# EAGLE design blink1mk3_003 (EAGLE 9.0.0)
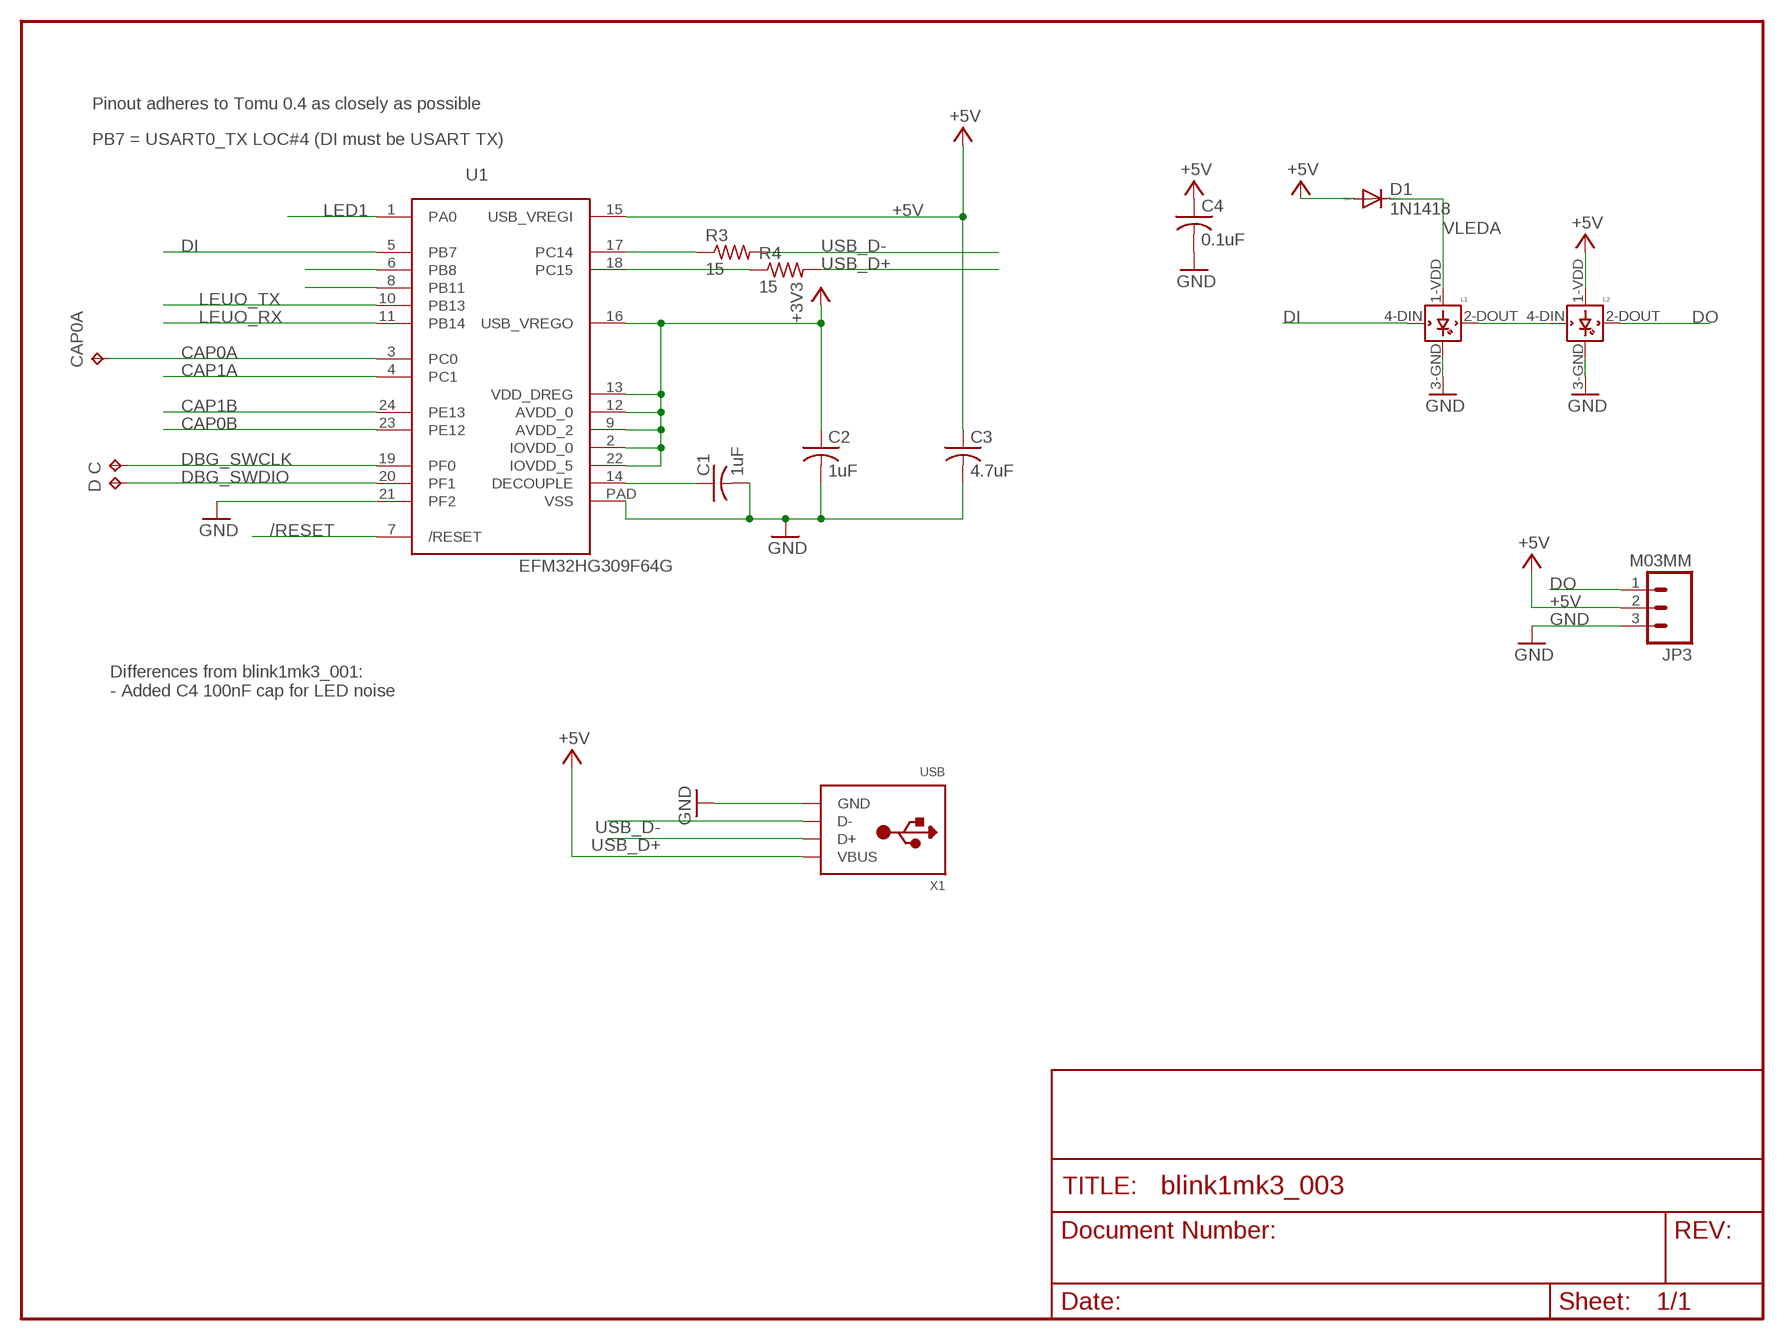
[diagram p0: schematic, sheet 1]

## Parts
C  TPTP10R  [TP10R]
C1  1uF  C-USC0402  [C0402]
C2  1uF  C-USC0402  [C0402]
C3  4.7uF  C-USC0402  [C0402]
C4  0.1uF  C-USC0402  [C0402]
CAP0A  TPTP10R  [TP10R]
D  TPTP10R  [TP10R]
D1  1N1418  DIODE-SOD523  [SOD523]
JP3  M03MM  [1X03-1.5MM]
L1  WS2812B  [WS2812B]
L2  WS2812B  [WS2812B]
R3  15  R-US_R0402  [R0402]
R4  15  R-US_R0402  [R0402]
U1  EFM32HG309F64G  [QFN24PAD]
X1  USB  [MOLEX-48037-1000]

## Nets
+3V3: C2.1 U1.2(IOVDD_0) U1.9(AVDD_2) U1.12(AVDD_0) U1.13(VDD_DREG) U1.16(USB_VREGO) U1.22(IOVDD_5)
+5V: C3.1 C4.1 D1.A JP3.2 L2.1-VDD(VDD) U1.15(USB_VREGI) X1.1(VBUS)
/RESET: U1.7(/RESET)
CAP0A: CAP0A.TP U1.3(PC0)
CAP0B: U1.23(PE12)
CAP1A: U1.4(PC1)
CAP1B: U1.24(PE13)
DBG_SWCLK: C.TP U1.19(PF0)
DBG_SWDIO: D.TP U1.20(PF1)
DECOUPLE: C1.1 U1.14(DECOUPLE)
DI: L1.4-DIN(DIN) U1.5(PB7)
DO: JP3.1 L2.2-DOUT(DOUT)
GND: C1.2 C2.2 C3.2 C4.2 JP3.3 L1.3-GND(GND) L2.3-GND(GND) U1.21(PF2) U1.PAD(VSS) X1.4(GND)
LED1: U1.1(PA0)
LEUO_RX: U1.11(PB14)
LEUO_TX: U1.10(PB13)
N$1: U1.8(PB11)
N$2: L1.2-DOUT(DOUT) L2.4-DIN(DIN)
N$3: U1.6(PB8)
RUSB_D+: R4.1 U1.18(PC15)
RUSB_D-: R3.1 U1.17(PC14)
USB_D+: R4.2 X1.3(D+)
USB_D-: R3.2 X1.2(D-)
VLEDA: D1.C L1.1-VDD(VDD)

## Notes on the sheet
- Pinout adheres to Tomu 0.4 as closely as possible
- PB7 = USART0_TX LOC#4 (DI must be USART TX)
- Differences from blink1mk3_001:
  - Added C4 100nF cap for LED noise

## Library data of the parts
C CAP0A D = testpad:TP: Test pad
C1-C4 = adafruit:C-US: CAPACITOR, American symbol
D1 = diode:DIODE-: DIODE
JP3 = todstuff:M03
L1 L2 = adafruit:WS2812B
R3 R4 = adafruit:R-US_: RESISTOR, American symbol
U1 = todstuff:EFM32HG309F64G
X1 = todstuff:USB

## Board
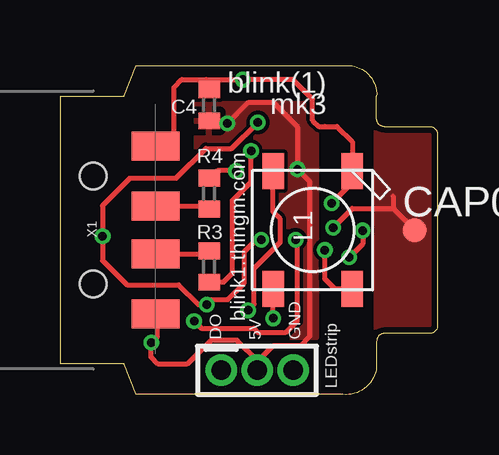
[diagram p1: board, top side]
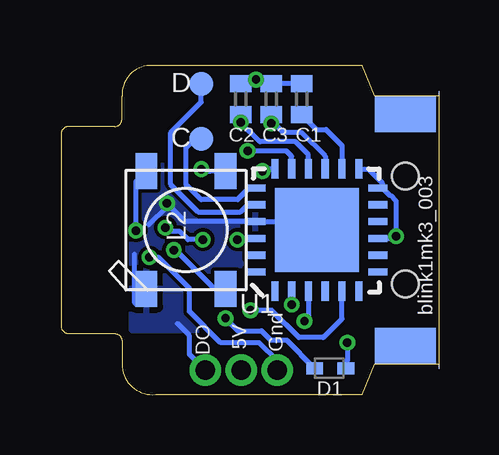
[diagram p2: board, bottom side, seen from below]

Size 15.75 x 13.72 mm. Coordinates in mm from the lower left corner, seen from the top.
Outline: 0,12.45 2.67,12.45 3.17,13.72 12.06,13.72 arc-90 13.21,12.45 13.21,11.5 arc90 13.53,11.18 15.43,11.18 arc-90 15.75,10.86 15.75,2.86 arc-90 15.43,2.55 13.53,2.55 arc90 13.21,2.23 13.21,1.15 arc-90 11.81,0.01 3.17,0.01 2.67,1.28 0,1.28 0,12.45
Copper layers (1*16): Top 0.035mm / dielectric 1.5mm / Bottom 0.035mm
Design rules "SeeedStudio_2layer_DRU_no_angle_20140221": minimum track width 6mil, minimum drill 12mil, track to track 6mil, track to pad 6mil, pad to pad 6mil, via to via 6mil, smd to smd 0mil, copper to edge 10mil, drill to drill 10mil, minimum pad ring 10mil, minimum via ring 6mil, stop-mask expansion 2mil, vias tented up to drill 100mil, thermal gap 10mil

### Footprints (pad centres in the part's own frame; a part is rotated, then mirrored left to right if it is on the bottom)
TP10R = smd 1 x 1: TP 0,0
C0402 = smd 0.7 x 0.9: 1 -0.65,0; 2 0.65,0
SOD523 = smd 0.7 x 0.5: A 0.7,0; C -0.6,0
1X03-1.5MM = drill 0.8 pad 1.27: 1 0,0; 2 1.5,0; 3 3,0
WS2812B = smd 1.5 x 0.9: 1-VDD 2.45,-1.65; 2-DOUT 2.45,1.65; 3-GND -2.45,1.65; 4-DIN -2.45,-1.65
R0402 = smd 0.7 x 0.9: 1 -0.65,0; 2 0.65,0
QFN24PAD = smd 0.8 x 0.3: 1 -2.55,1.75; 2 -2.55,1.05; 3 -2.55,0.35; 4 -2.55,-0.35; 5 -2.55,-1.05; 6 -2.55,-1.75; 13 2.55,-1.75; 14 2.55,-1.05; 15 2.55,-0.35; 16 2.55,0.35; 17 2.55,1.05; 18 2.55,1.75 | smd 0.3 x 0.8: 7 -1.75,-2.55; 8 -1.05,-2.55; 9 -0.35,-2.55; 10 0.35,-2.55; 11 1.05,-2.55; 12 1.75,-2.55; 19 1.75,2.55; 20 1.05,2.55; 21 0.35,2.55; 22 -0.35,2.55; 23 -1.05,2.55; 24 -1.75,2.55 | smd 3.5 x 3.5: PAD 0,0
MOLEX-48037-1000 = smd 2 x 1.2: 1 2.6,-3.5; 2 2.6,-1; 3 2.6,1; 4 2.6,3.5 | smd 2.54 x 1.524 bottom: P$1 0,4.85; P$2 0,-4.85 | hole 1.1: 0,2.25; 0,-2.25

### Placement (x,y rotation side)
C  9.91,10.67 0 bottom
C1  5.71,12.33 90 bottom
C2  8.25,12.33 90 bottom
C3  6.99,12.33 90 bottom
C4  6.22,12.07 90 top
CAP0A  14.8,6.86 0 top
D  9.91,12.96 0 bottom
D1  4.57,1.1 0 bottom
JP3  6.73,1.02 0 top
L1  10.54,6.86 270 top
L2  10.54,6.86 90 bottom
R3  6.22,5.34 90 top
R4  6.22,8.39 270 top
U1  5.08,6.86 90 bottom
X1  1.39,6.86 0 top

### Tracks (layer width: path | path; a pad name or v marks a point on that pad's centre or on a via)
+3V3  (via drill 0.35)
  Top 0.203: v8.25,11.36 7.16,10.26 6.09,10.26 4.85,9.02 2.92,9.02 1.78,7.88 v1.78,6.61 1.78,5.59 2.79,4.58 4.95,4.58 5.77,3.76 v6.13,3.76 6.34,3.96 7,3.96 7.7,4.66 7.7,5.96 8.2,6.46 v8.4,6.46
  Bottom 0.203: U1.13 2.93,9.41 2.35,8.83 2.35,8.61 | U1.9 1.87,6.51 v1.78,6.61 1.78,8.07 2.02,8.32 2.05,8.32 2.35,8.61 | U1.12 2.35,8.61 | U1.2 v6.13,3.76 | U1.16 5.46,9.45 5.46,10.04 5.97,10.55 7.45,10.55 v8.25,11.36 | C2.1 v8.25,11.36 | v8.25,11.36 | U1.22 8.35,6.51 v8.4,6.46
+5V  (via drill 0.35)
  Top 0.203: 4.02,3.36 X1.1 4.05,3.3 4.05,2.41 v3.81,2.17 3.81,1.58 3.8,1.56 4.1,1.26 5.3,1.26 6.3,2.26 7.39,2.26 8.25,1.4 | 8.25,1.4 8.23,1.38 JP3.2 | 8.25,1.4 8.89,2.04 10.03,2.04 10.41,2.42 10.41,8.9 v9.91,9.4 9.91,11.18 8.89,12.2 7.87,12.2 v6.99,11.31 6.33,11.31 C4.1
  Bottom 0.203: L2.1-VDD 9.53,9.31 9.91,9.31 v9.91,9.4 | v6.99,11.31 6.94,11.34 C3.1 v6.99,11.31 | U1.15 4.73,9.94 5.71,10.93 6.48,10.93 6.86,11.31 v6.99,11.31 | v3.81,2.17 3.81,1.47 D1.A
  pour Top: 5.7,12.16 10.7,12.16 10.7,2.36 7.6,2.36 7.6,10.26 5.7,10.26
CAP0A  (via drill 0.35)
  Top 0.203: v9.83,6.46 9.9,6.46 9.9,3.06 9.43,2.6 8.25,2.6 8.08,2.76 5.9,2.76 v5.6,3.06 | 13.9,8.26 13.9,7.76 | 13.9,7.76 CAP0A.TP | v11.4,6.96 12.2,7.76 13.9,7.76
  Bottom 0.203: v11.4,6.96 11.24,6.81 10.81,6.81 10.46,6.46 v9.83,6.46 | v5.6,3.06 5.43,3.23 U1.3
  pour Top (no thermals): 13.2,11.16 15.8,11.16 15.8,2.36 13.2,2.36
DBG_SWCLK
  Bottom 0.203: U1.19 7.9,8.61 8.38,8.13 9.91,8.13 10.54,8.77 10.54,10.29 10.16,10.67 C.TP
DBG_SWDIO
  Bottom 0.203: U1.20 7.97,7.91 8.25,7.63 10.03,7.63 11.18,8.77 11.18,10.93 9.91,12.2 9.91,12.63 9.91,12.83 D.TP
DECOUPLE
  Bottom 0.152: 5.71,11.44 C1.1
  Bottom 0.203: C1.1 5.09,11.06 4.7,11.06 4.03,10.39 U1.14
DI  (via drill 0.35)
  Top 0.203: L1.4-DIN 8.89,7.63 9.2,7.32 9.2,6.36 8.1,5.26 8.1,3.76 v7.85,3.51
  Bottom 0.203: U1.5 4.03,3.16 4.81,2.38 5.84,2.38 6.97,3.51 v7.85,3.51
DO  (via drill 0.35)
  Top 0.203: v12.06,5.73 12.63,6.29 v12.63,6.84
  Bottom 0.203: v12.63,6.84 12.63,8.88 L2.2-DOUT | JP3.1 6.73,1.4 7.49,2.17 9.1,2.17 10.4,3.46 10.4,4.43 11.69,5.73 v12.06,5.73
GND  (via drill 0.35)
  Top 0.203: L1.3-GND 12.19,8.71 | 6.1,13.14 5.08,13.14 4.75,12.81 4.75,10.47 4.64,10.36 X1.4 | 6.1,13.14 v7.62,13.14 9.72,13.14 10.54,12.33 10.54,11.44 10.79,11.18 11.05,11.18 | 11.05,11.18 11.56,11.18 12.19,10.55 L1.3-GND | 11.06,11.17 11.05,11.18 | C4.2 6.1,12.85 6.1,13.14 | L1.3-GND 12.19,8.84 v11.33,7.98
  Bottom 0.203: 5.56,7.21 U1.PAD | 11.23,7.88 v11.33,7.98 | 5.33,6.86 U1.PAD | U1.PAD 5.43,7.21 U1.21 10.57,7.21 11.23,7.88 | v7.62,13.14 8.42,13.14 C2.2 C3.2 C1.2 | 11.23,7.88 11.35,7.96 11.35,7.83 12.1,7.09 | JP3.3 10.4,1.69 10.4,2.46 10.9,2.96 | L2.3-GND 12.19,4.17 12.6,3.76 12.7,3.86 12.7,5.86
  pour Bottom: 7.6,9.56 7.6,2.66 12.8,2.66 12.8,9.46 12.7,9.56
N$2  (via drill 0.35)
  Top 0.203: 11.97,4.41 L1.2-DOUT 11.47,4.41 11.05,4.83 v11.05,6.03
  Bottom 0.203: L2.4-DIN 9.35,4.41 10.96,6.03 v11.05,6.03
RUSB_D+  (via drill 0.35)
  Top 0.203: R4.1 6.27,9.04 6.6,9.36 7.3,9.36 v7.35,9.32
  Bottom 0.203: U1.18 7.31,9.41 v7.35,9.32
RUSB_D-  (via drill 0.35)
  Top 0.203: 7.97,9.94 v7.97,10.17 7.97,8.87 7.2,8.1 7.2,5.06 6.82,4.69 R3.1
  Bottom 0.203: U1.17 6.13,9.95 6.35,10.17 v7.97,10.17
USB_D+
  Top 0.203: X1.3 6.48,7.86 R4.2
USB_D-
  Top 0.203: X1.2 6.48,5.86 R3.2
VLEDA  (via drill 0.35)
  Top 0.203: v8.89,3.18 L1.1-VDD
  Bottom 0.203: v8.89,3.18 8.37,2.66 7.4,2.66 7,2.26 6.33,2.26 D1.C 5.34,1.1

### Text on the board
tPlace: blink(1) | mk3 | blink1.thingm.com | DO | 5V | GND | LEDstrip
bPlace: Gnd | blink1mk3_003 | 5V | DO